# EAGLE schematic rev0.1 (EAGLE 8.4.3)

## Sheet 1 of 2
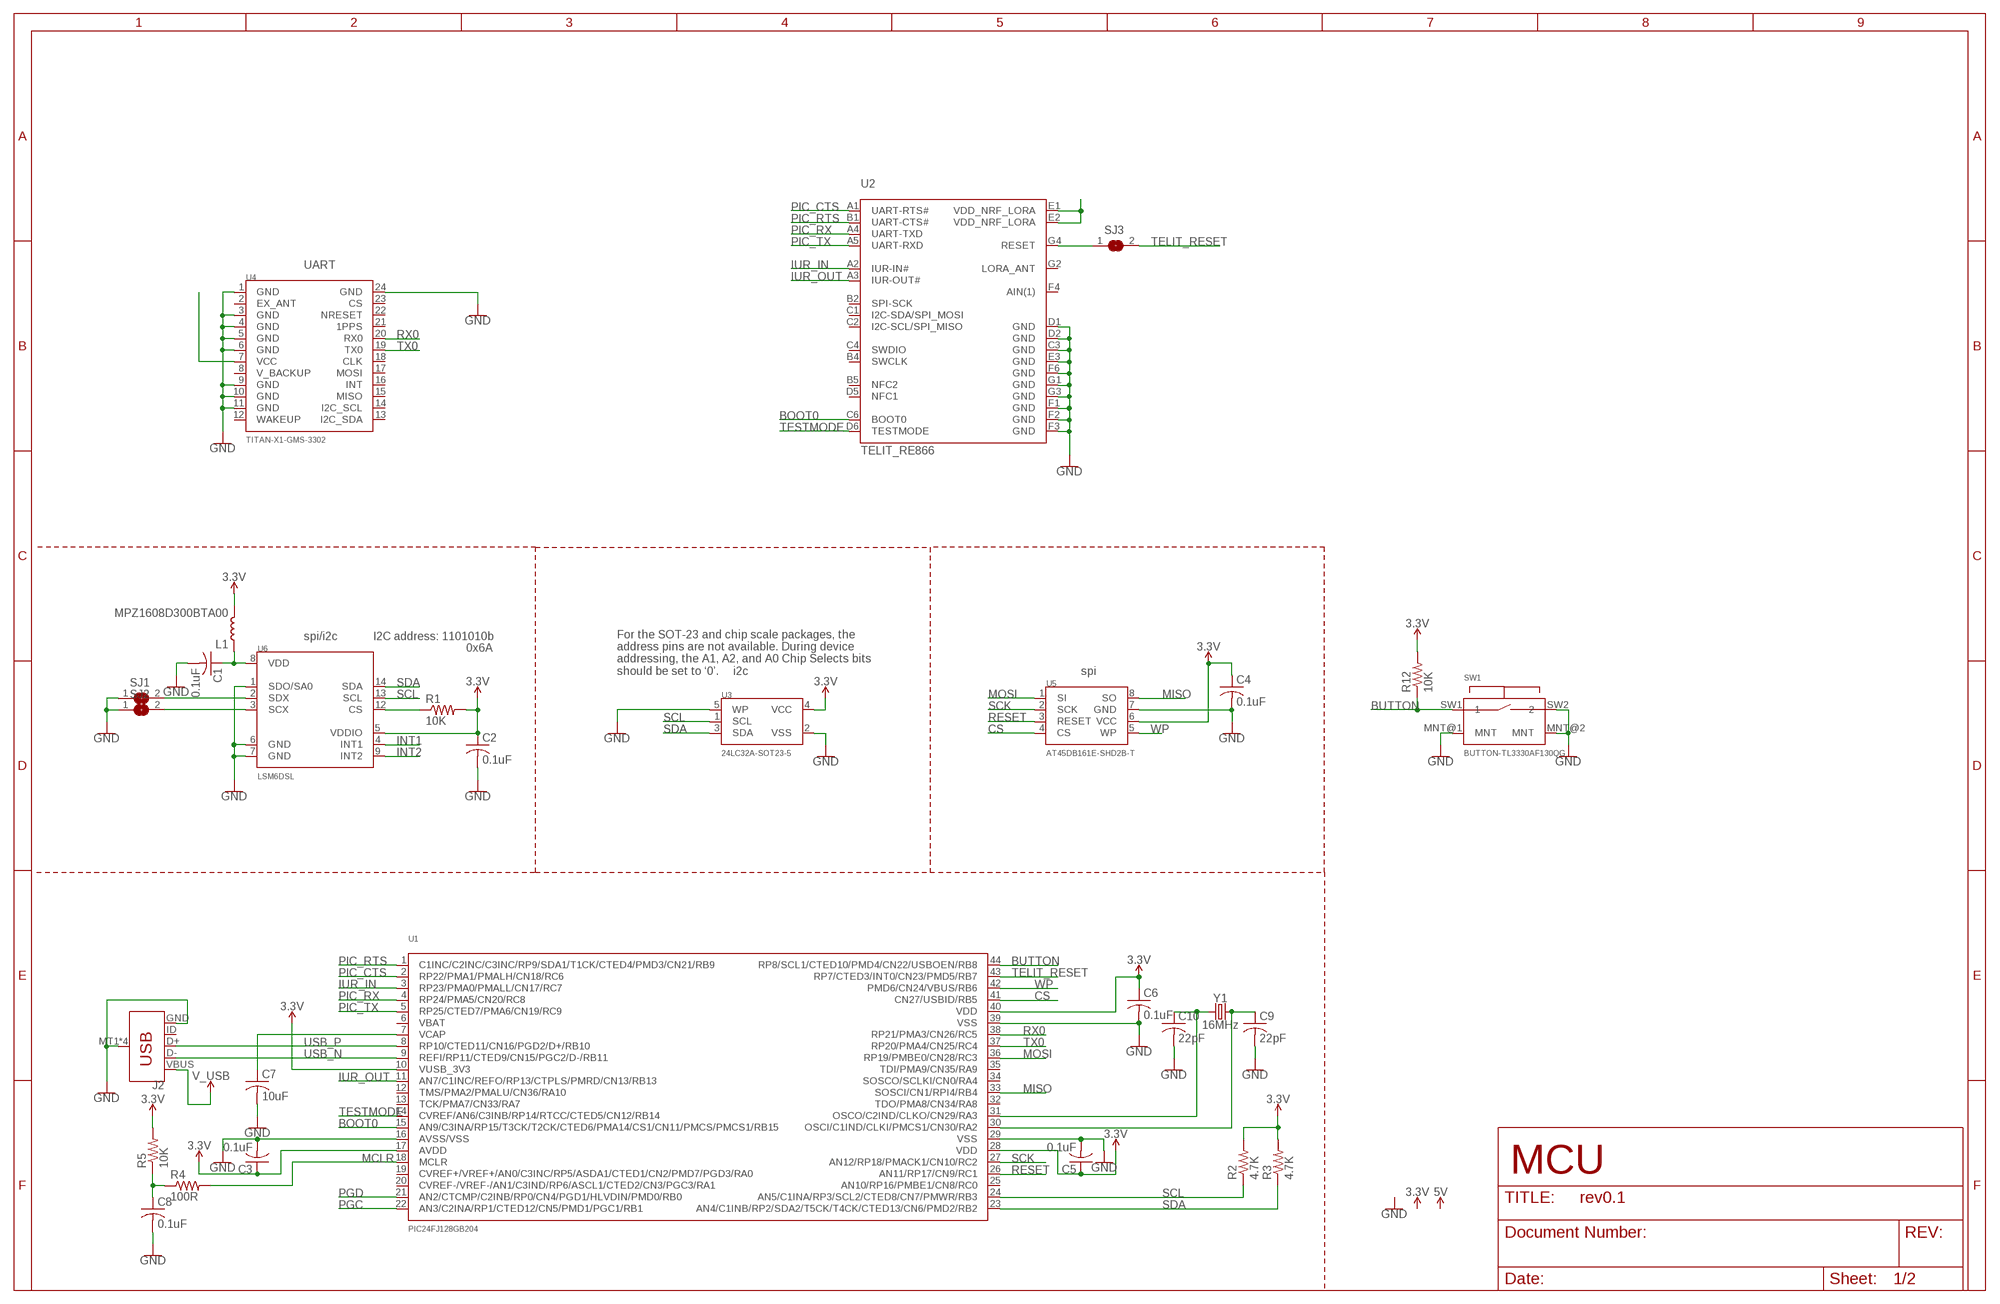
[diagram p0: schematic, sheet 1]

### Parts
C1  0.1uF  C-USC0402  [C0402]
C2  0.1uF  C-USC0402  [C0402]
C3  0.1uF  C-USC0402  [C0402]
C4  0.1uF  C-USC0402  [C0402]
C5  0.1uF  C-USC0402  [C0402]
C6  0.1uF  C-USC0402  [C0402]
C7  10uF  C-USC0603  [C0603]
C8  0.1uF  C-USC0402  [C0402]
C9  22pF  C-USC0402  [C0402]
C10  22pF  C-USC0402  [C0402]
J2  USB_MICRO-B_SMT  [USB-MICROB]
L1  MPZ1608D300BTA00  INDUCTOR-0402-3.9NH  [0402]
R1  10K  R-US_R0402  [R0402]
R2  4.7K  R-US_R0402  [R0402]
R3  4.7K  R-US_R0402  [R0402]
R4  100R  R-US_R0402  [R0402]
R5  10K  R-US_R0402  [R0402]
R12  10K  R-US_R0402  [R0402]
SJ1  SJ  [SJ]
SJ2  SJ  [SJ]
SJ3  SJ  [SJ]
SW1  BUTTON-TL3330AF130QG  [BUTTON-TL3330AF130QG]
U1  PIC24FJ128GB204  [PIC24FJ128GB204]
U2  TELIT_RE866  [TELIT_RE866]
U3  24LC32A-SOT23-5  [24LC32A-SOT23-5]
U4  TITAN-X1-GMS-3302  [TITAN-X1-GMS-3302]
U5  AT45DB161E-SHD2B-T  [AT45DB161E-SHD2B-T]
U6  LSM6DSL  [LSM6DSL]
Y1  16MHz  CRYSTAL-16MHZSMD-5X3.2  [CRYSTAL-SMD-5X3.2-4PAD]

### Nets
3.3V: C2.1 C3.1 C4.1 C5.1 C6.1 L1.2 R1.2 R2.2 R3.2 R5.2 R12.2 U1.10(VUSB_3V3) U1.17(AVDD) U1.28(VDD) U1.40(VDD) U3.4(VCC) U5.6(VCC) U6.5(VDDIO) ; also sheet 2
BOOT0: U1.15(AN9/C3INA/RP15/T3CK/T2CK/CTED6/PMA14/CS1/CN11/PMCS/PMCS1/RB15) U2.C6(BOOT0)
BUTTON: R12.1 SW1.SW1 U1.44(RP8/SCL1/CTED10/PMD4/CN22/USBOEN/RB8)
CS: U1.41(CN27/USBID/RB5) U5.4(CS)
GND: C1.2 C2.2 C3.2 C4.2 C5.2 C6.2 C7.2 C8.2 C9.2 C10.2 J2.GND J2.MT1(SHIELD) J2.MT2(SHIELD) J2.P$1(SHIELD) J2.P$2(SHIELD) SJ1.1 SJ2.1 SW1.MNT@1(MNT) SW1.MNT@2(MNT) SW1.SW2 U1.16(AVSS/VSS) U1.29(VSS) U1.39(VSS) U2.C3(GND) U2.D1(GND) U2.D2(GND) U2.E3(GND) U2.F1(GND) U2.F2(GND) U2.F3(GND) U2.F6(GND) U2.G1(GND) U2.G3(GND) U3.2(VSS) U3.5(WP) U4.1(GND) U4.3(GND) U4.4(GND) U4.5(GND) U4.6(GND) U4.9(GND) U4.10(GND) U4.11(GND) U4.24(GND) U5.7(GND) U6.1(SDO/SA0) U6.6(GND) U6.7(GND) ; also sheet 2
INT1: U6.4(INT1)
INT2: U6.9(INT2)
IUR_IN: U1.3(RP23/PMA0/PMALL/CN17/RC7) U2.A2(IUR-IN#)
IUR_OUT: U1.11(AN7/C1INC/REFO/RP13/CTPLS/PMRD/CN13/RB13) U2.A3(IUR-OUT#)
MCLR: R4.2 U1.18(MCLR)
MISO: U1.33(SOSCI/CN1/RPI4/RB4) U5.8(SO)
MOSI: U1.36(RP19/PMBE0/CN28/RC3) U5.1(SI)
N$1: SJ1.2 U6.2(SDX)
N$2: SJ2.2 U6.3(SCX)
N$3: R1.1 U6.12(CS)
N$5: C1.1 L1.1 U6.8(VDD)
N$6: C8.1 R4.1 R5.1
N$7: C9.1 U1.30(OSCI/C1IND/CLKI/PMCS1/CN30/RA2) Y1.3
N$8: C10.1 U1.31(OSCO/C2IND/CLKO/CN29/RA3) Y1.1
N$9: C7.1 U1.7(VCAP)
N$11: U4.7(VCC)
N$12: U2.E1(VDD_NRF_LORA) U2.E2(VDD_NRF_LORA)
N$18: SJ3.1 U2.G4(RESET)
PGC: U1.22(AN3/C2INA/RP1/CTED12/CN5/PMD1/PGC1/RB1)
PGD: U1.21(AN2/CTCMP/C2INB/RP0/CN4/PGD1/HLVDIN/PMD0/RB0)
PIC_CTS: U1.2(RP22/PMA1/PMALH/CN18/RC6) U2.A1(UART-RTS#)
PIC_RTS: U1.1(C1INC/C2INC/C3INC/RP9/SDA1/T1CK/CTED4/PMD3/CN21/RB9) U2.B1(UART-CTS#)
PIC_RX: U1.4(RP24/PMA5/CN20/RC8) U2.A4(UART-TXD)
PIC_TX: U1.5(RP25/CTED7/PMA6/CN19/RC9) U2.A5(UART-RXD)
RESET: U1.26(AN11/RP17/CN9/RC1) U5.3(RESET)
RX0: U1.38(RP21/PMA3/CN26/RC5) U4.20(RX0)
SCK: U1.27(AN12/RP18/PMACK1/CN10/RC2) U5.2(SCK)
SCL: R2.1 U1.24(AN5/C1INA/RP3/SCL2/CTED8/CN7/PMWR/RB3) U3.1(SCL) U6.13(SCL)
SDA: R3.1 U1.23(AN4/C1INB/RP2/SDA2/T5CK/T4CK/CTED13/CN6/PMD2/RB2) U3.3(SDA) U6.14(SDA)
TELIT_RESET: SJ3.2 U1.43(RP7/CTED3/INT0/CN23/PMD5/RB7)
TESTMODE: U1.14(CVREF/AN6/C3INB/RP14/RTCC/CTED5/CN12/RB14) U2.D6(TESTMODE)
TX0: U1.37(RP20/PMA4/CN25/RC4) U4.19(TX0)
USB_N: J2.D- U1.9(REFI/RP11/CTED9/CN15/PGC2/D-/RB11)
USB_P: J2.D+ U1.8(RP10/CTED11/CN16/PGD2/D+/RB10)
V_USB: J2.VBUS ; also sheet 2
WP: U1.42(PMD6/CN24/VBUS/RB6) U5.5(WP)
Unconnected: J2.ID U1.6(VBAT) U1.12(TMS/PMA2/PMALU/CN36/RA10) U1.13(TCK/PMA7/CN33/RA7) U1.19(CVREF+/VREF+/AN0/C3INC/RP5/ASDA1/CTED1/CN2/PMD7/PGD3/RA0) U1.20(CVREF-/VREF-/AN1/C3IND/RP6/ASCL1/CTED2/CN3/PGC3/RA1) U1.25(AN10/RP16/PMBE1/CN8/RC0) U1.32(TDO/PMA8/CN34/RA8) U1.34(SOSCO/SCLKI/CN0/RA4) U1.35(TDI/PMA9/CN35/RA9) U2.B2(SPI-SCK) U2.B4(SWCLK) U2.B5(NFC2) U2.C1(I2C-SDA/SPI_MOSI) U2.C2(I2C-SCL/SPI_MISO) U2.C4(SWDIO) U2.D5(NFC1) U2.F4(AIN(1)) U2.G2(LORA_ANT) U4.2(EX_ANT) U4.8(V_BACKUP) U4.12(WAKEUP) U4.13(I2C_SDA) U4.14(I2C_SCL) U4.15(MISO) U4.16(INT) U4.17(MOSI) U4.18(CLK) U4.21(1PPS) U4.22(NRESET) U4.23(CS)

### Notes on the sheet
- UART
- spi/i2c | I2C address: 1101010b
- 0x6A
- For the SOT-23 and chip scale packages, the
  address pins are not available. During device
  addressing, the A1, A2, and A0 Chip Selects bits
  should be set to ‘0’.
- i2c | spi
- MCU

## Sheet 2 of 2
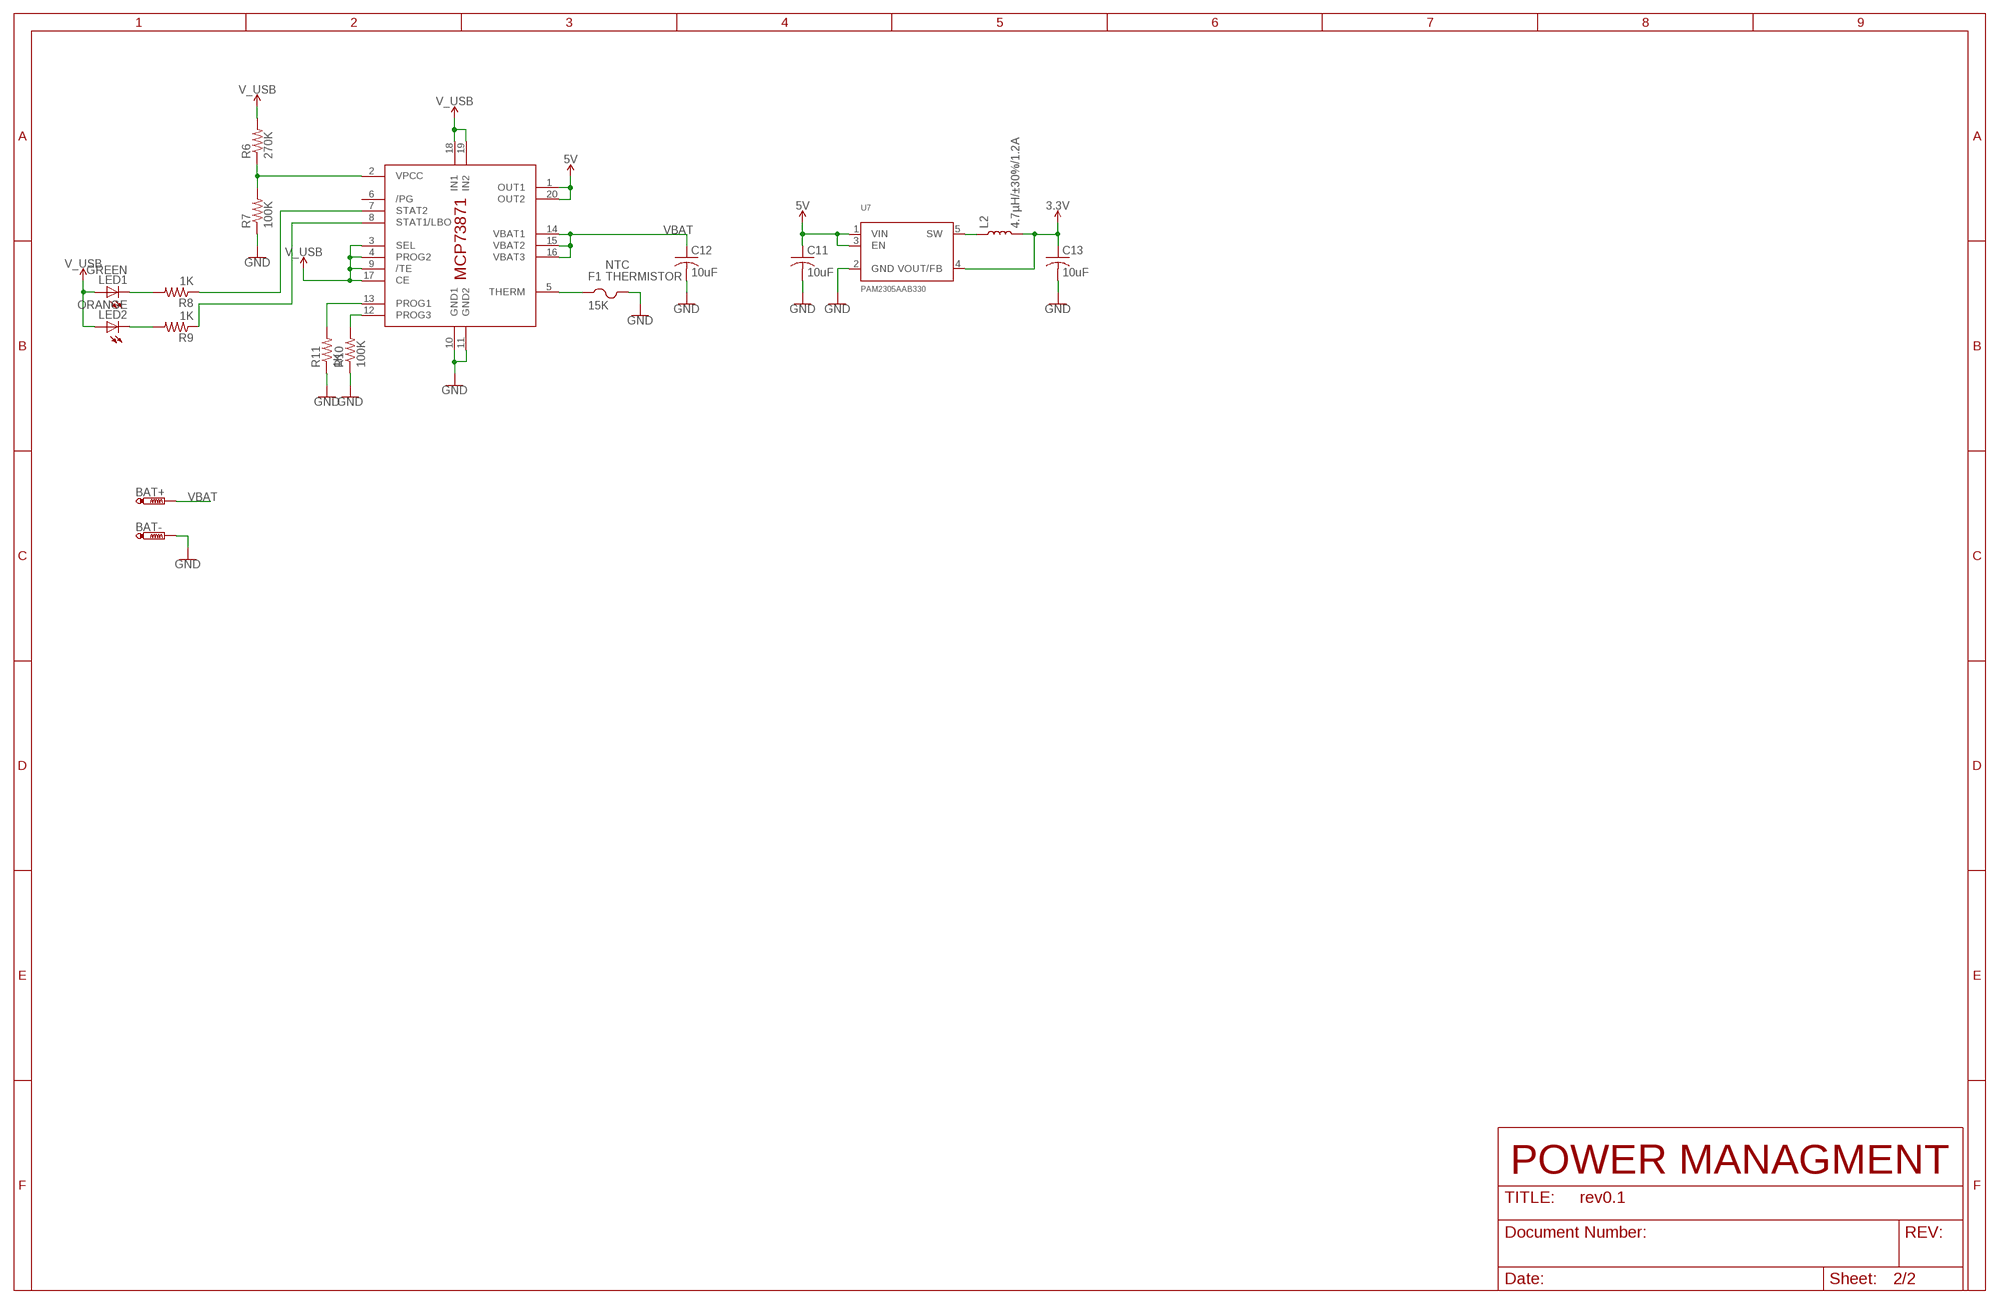
[diagram p1: schematic, sheet 2]

### Parts
BAT+  PTR1B2,54  [B2,54]
BAT-  PTR1B2,54  [B2,54]
C11  10uF  C-USC0805  [C0805]
C12  10uF  C-USC0603  [C0603]
C13  10uF  C-USC0805  [C0805]
F1  15K  PTCFUSE-1206  [R1206]
IC2  MCP73871  [QFN20]
L2  4.7µH/±30%/1.2A  INDUCTOR-CDRH-4.7UH  [INDUCTOR_4.7UH]
LED1  GREEN  LEDCHIP-LED0603  [CHIP-LED0603]
LED2  ORANGE  LEDCHIP-LED0603  [CHIP-LED0603]
R6  270K  R-US_R0402  [R0402]
R7  100K  R-US_R0402  [R0402]
R8  1K  R-US_R0402  [R0402]
R9  1K  R-US_R0402  [R0402]
R10  100K  R-US_R0402  [R0402]
R11  1K  R-US_R0402  [R0402]
U7  PAM2305AAB330  [PAM2305AAB330]

### Nets
3.3V: C13.1 L2.P$2 U7.4(VOUT/FB) ; also sheet 1
5V: C11.1 IC2.1(OUT1) IC2.20(OUT2) U7.1(VIN) U7.3(EN)
GND: BAT-.TP C11.2 C12.2 C13.2 F1.2 IC2.10(GND1) IC2.11(GND2) R7.1 R10.1 R11.1 U7.2(GND) ; also sheet 1
N$10: IC2.2(VPCC) R6.1 R7.2
N$13: LED1.C R8.2
N$14: LED2.C R9.2
N$15: IC2.7(STAT2) R8.1
N$16: IC2.8(STAT1/LBO) R9.1
N$17: L2.P$1 U7.5(SW)
N$19: IC2.12(PROG3) R10.2
N$20: IC2.13(PROG1) R11.2
N$24: F1.1 IC2.5(THERM)
V_USB: IC2.3(SEL) IC2.4(PROG2) IC2.9(/TE) IC2.17(CE) IC2.18(IN1) IC2.19(IN2) LED1.A LED2.A R6.2 ; also sheet 1
VBAT: BAT+.TP C12.1 IC2.14(VBAT1) IC2.15(VBAT2) IC2.16(VBAT3)
Unconnected: IC2.6(/PG)

### Notes on the sheet
- NTC
- THERMISTOR
- POWER MANAGMENT

## Library data of the parts
BAT+ BAT- = testpad:PTR1: TEST PIN
C1-C13 = resistor:C-US: CAPACITOR, American symbol
F1 = adafruit:PTCFUSE: PTC fuses, resettable thermistors
IC2 = adafruit:MCP73871
J2 = SparkFun-Connectors:USB_MICRO-B: USB Type Micro-B Connector Male/female and PTH/SMT variants SparkFun Products: SparkFun microB USB Breakout <https://www.sparkfun.com/products/12035> SparkFun USB microB Plug Breakout <https://www.sparkfun.com/products/10031> SparkFun ESP8266 Thing <https://www.sparkfun.com/products/13231>; PROD_ID: CONN-09505; SF_ID: PRT-08533
L1 = SparkFun-Coils:INDUCTOR: Inductors Resist changes in electrical current. Basically a coil of wire. SparkFun Products: SparkFun Load Cell Amplifier - HX711 <https://www.sparkfun.com/products/13879> IOIO-OTG - V2.2 <https://www.sparkfun.com/products/13613>; PROD_ID: NDUC-13457; VALUE: 3.9NH
L2 = SparkFun-Coils:INDUCTOR: Inductors Resist changes in electrical current. Basically a coil of wire. SparkFun Products: SparkFun Load Cell Amplifier - HX711 <https://www.sparkfun.com/products/13879> IOIO-OTG - V2.2 <https://www.sparkfun.com/products/13613>; PROD_ID: NDUC-10146
LED1 LED2 = adafruit:LED: LED OSRAM: - CHIPLED LG R971, LG N971, LY N971, LG Q971, LY Q971, LO R971, LY R971 LH N974, LH R974 LS Q976, LO Q976, LY Q976 LO Q996 - Hyper CHIPLED LW Q18S LB Q993, LB Q99A, LB R99A - SideLED LS A670, LO A670, LY A670, LG A670, LP A670 LB A673, LV A673, LT A673, LW A673 LH A674 LY A675 LS A676, LA A676, LO A676, LY A676, LW A676 LS A679, LY A679, LG A679 - Hyper Micro SIDELED® LS Y876, LA Y876, LO Y876, LY Y876 LT Y87S - SmartLED LW L88C, LW L88S LB L89C, LB L89S, LG L890 LS L89K, LO L89K, LY L89K LS L896, LA L896, LO L896, LY L896 - TOPLED LS T670, LO T670, LY T670, LG T670, LP T670 LSG T670, LSP T670, LSY T670, LOP T670, LYG T670 LG T671, LOG T671, LSG T671 LB T673, LV T673, LT T673, LW T673 LH T674 LS T676, LA T676, LO T676, LY T676, LB T676, LH T676, LSB T676, LW T676 LB T67C, LV T67C, LT T67C, LS T67K, LO T67K, LY T67K, LW E67C LS E67B, LA E67B, LO E67B, LY E67B, LB E67C, LV E67C, LT E67C LW T67C LS T679, LY T679, LG T679 LS T770, LO T770, LY T770, LG T770, LP T770 LB T773, LV T773, LT T773, LW T773 LH T774 LS E675, LA E675, LY E675, LS T675 LS T776, LA T776, LO T776, LY T776, LB T776 LHGB T686 LT T68C, LB T68C - Hyper Mini TOPLED® LB M676 - Mini TOPLED Santana® LG M470 LS M47K, LO M47K, LY M47K Source: http://www.osram.convergy.de/
R1-R12 = resistor:R-US_: RESISTOR, American symbol
SJ1-SJ3 = jumper:SJ: SMD solder JUMPER
SW1 = clackboard_lib:BUTTON-TL3330AF130QG
U1 = clackboard_lib:PIC24FJ128GB204
U2 = clackboard_lib:TELIT_RE866
U3 = clackboard_lib:24LC32A-SOT23-5
U4 = clackboard_lib:TITAN-X1-GMS-3302
U5 = clackboard_lib:AT45DB161E-SHD2B-T
U6 = clackboard_lib:LSM6DSL; SPICEPREFIX: X
U7 = clackboard_lib:PAM2305AAB330
Y1 = SparkFun-Clocks:CRYSTAL-16MHZ: 16MHz Crystal Digikey Example <http://www.digikey.com/product-search/en?keywords=535-9122-1-ND> Frequency: 16MHz Frequency Stability: ±50ppm Frequency Tolerance: ±20ppm Load Capacitance: 18pF SparkFun Products: Pro Micro -5V/16MHz <https://www.sparkfun.com/products/12640> SparkFun Serial Enabled LCD Kit <https://www.sparkfun.com/products/10097>; PROD_ID: XTAL-08218; SF_ID: COM-00094